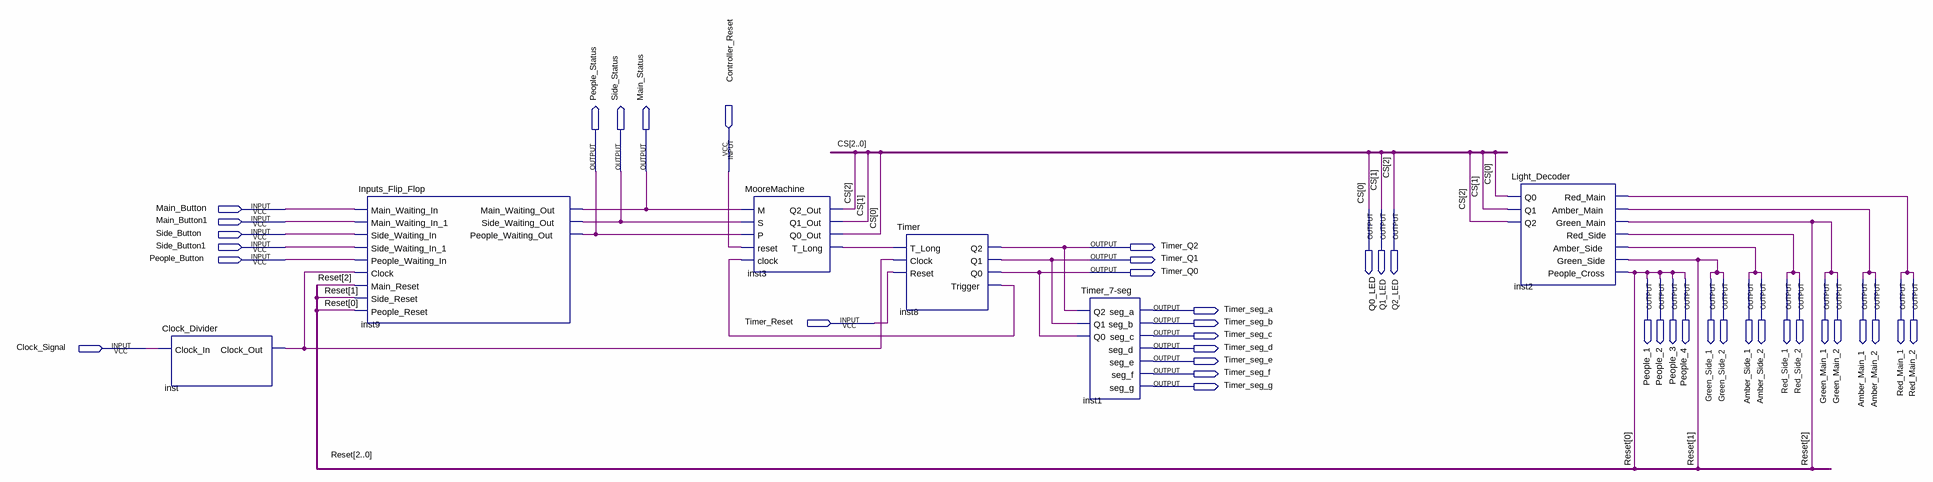
[diagram p0: schematic sheet]
// Quartus schematic Main.bdf as structural Verilog: 6 symbols, 40 pins
module Main (
  input  Controller_Reset,
  input  Main_Button,
  input  Main_Button1,
  input  Side_Button,
  input  Side_Button1,
  input  People_Button,
  input  Timer_Reset,
  input  Clock_Signal,
  output People_Status,
  output Side_Status,
  output Main_Status,
  output Q0_LED,
  output Q1_LED,
  output Q2_LED,
  output Timer_Q2,
  output Timer_Q1,
  output Timer_Q0,
  output People_1,
  output People_2,
  output People_3,
  output People_4,
  output Green_Side_1,
  output Green_Side_2,
  output Amber_Side_1,
  output Amber_Side_2,
  output Red_Side_1,
  output Red_Side_2,
  output Green_Main_1,
  output Green_Main_2,
  output Amber_Main_1,
  output Amber_Main_2,
  output Red_Main_1,
  output Red_Main_2,
  output Timer_seg_a,
  output Timer_seg_b,
  output Timer_seg_c,
  output Timer_seg_d,
  output Timer_seg_e,
  output Timer_seg_f,
  output Timer_seg_g
);

  wire inst3_t_long, inst8_trigger, inst_clock_out;

  Clock_Divider inst (.Clock_In(Clock_Signal), .Clock_Out(inst_clock_out));
  Inputs_Flip_Flop inst9 (
    .Main_Waiting_In(Main_Button), .Main_Waiting_In_1(Main_Button1), .Side_Waiting_In(Side_Button),
    .Side_Waiting_In_1(Side_Button1), .People_Waiting_In(People_Button), .Clock(inst_clock_out),
    .Main_Reset(Green_Main_1), .Side_Reset(Green_Side_1), .People_Reset(People_1),
    .Main_Waiting_Out(Main_Status), .Side_Waiting_Out(Side_Status), .People_Waiting_Out(People_Status));
  MooreMachine inst3 (
    .M(Main_Status), .S(Side_Status), .P(People_Status), .reset(Controller_Reset), .clock(inst8_trigger),
    .Q2_Out(Q2_LED), .Q1_Out(Q1_LED), .Q0_Out(Q0_LED), .T_Long(inst3_t_long));
  Timer inst8 (
    .T_Long(inst3_t_long), .Clock(inst_clock_out), .Reset(Timer_Reset), .Q2(Timer_Q2), .Q1(Timer_Q1),
    .Q0(Timer_Q0), .Trigger(inst8_trigger));
  \Timer_7-seg  inst1 (
    .Q2(Timer_Q2), .Q1(Timer_Q1), .Q0(Timer_Q0), .seg_a(Timer_seg_a), .seg_b(Timer_seg_b),
    .seg_c(Timer_seg_c), .seg_d(Timer_seg_d), .seg_e(Timer_seg_e), .seg_f(Timer_seg_f), .seg_g(Timer_seg_g));
  Light_Decoder inst2 (
    .Q0(Q0_LED), .Q1(Q1_LED), .Q2(Q2_LED), .Red_Main(Red_Main_1), .Amber_Main(Amber_Main_1),
    .Green_Main(Green_Main_1), .Red_Side(Red_Side_1), .Amber_Side(Amber_Side_1), .Green_Side(Green_Side_1),
    .People_Cross(People_1));

  assign Amber_Main_2 = Amber_Main_1;
  assign Amber_Side_2 = Amber_Side_1;
  assign Green_Main_2 = Green_Main_1;
  assign Green_Side_2 = Green_Side_1;
  assign People_2 = People_1;
  assign People_3 = People_1;
  assign People_4 = People_1;
  assign Red_Main_2 = Red_Main_1;
  assign Red_Side_2 = Red_Side_1;

  // Other names for the same wires on the sheet: CS[2:0] = {Q2_LED, Q1_LED, Q0_LED};
  //   Reset[2:0] = {Green_Main_1, Green_Side_1, People_1}
endmodule
